# EAGLE design nau7802 (EAGLE 6.4)
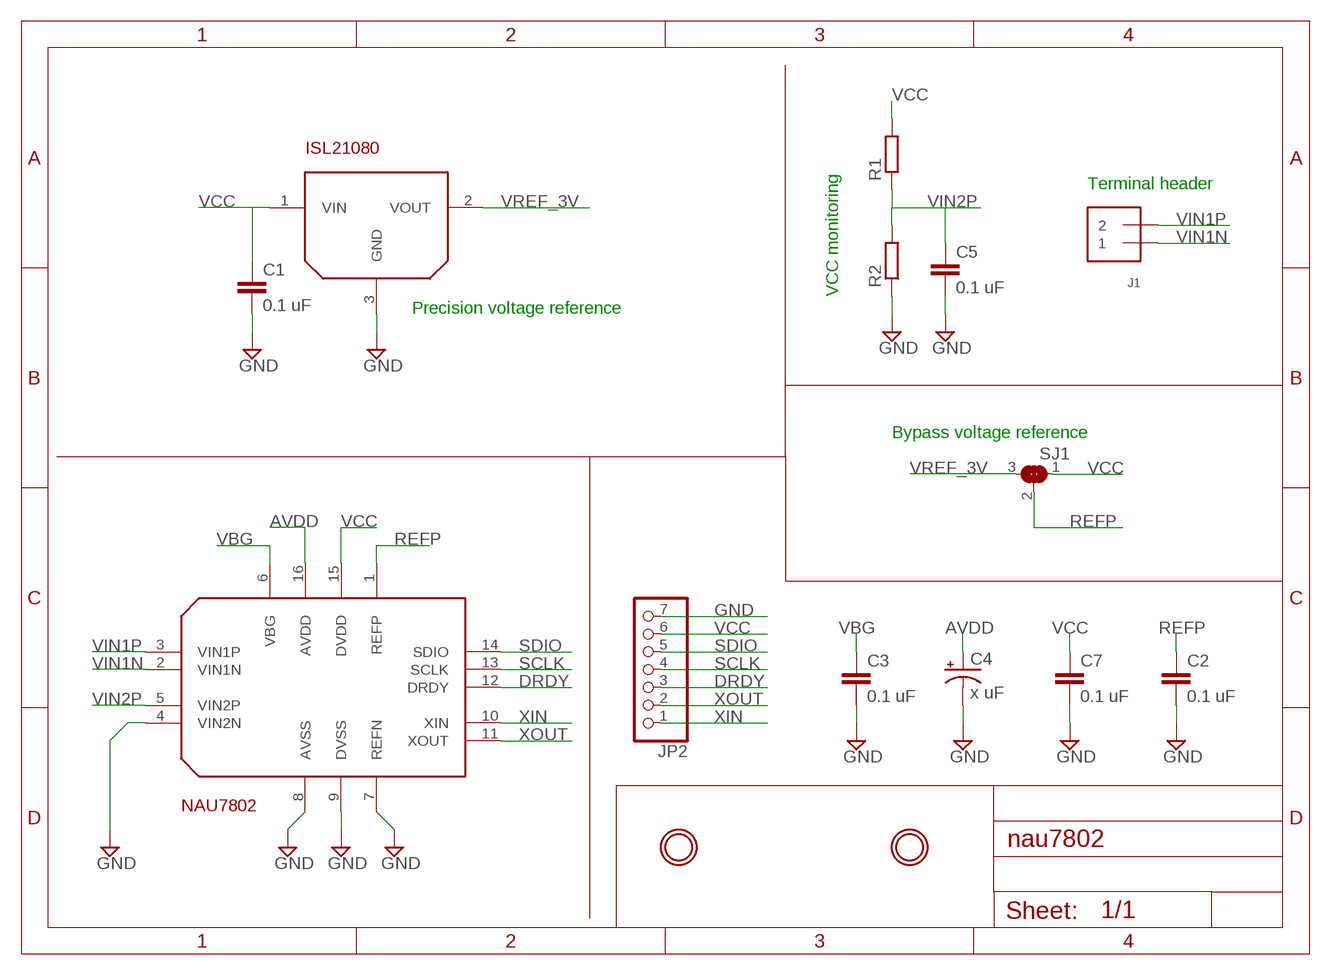
[diagram p0: schematic, sheet 1]

## Parts
C1  0.1 uF  C-EUC0805  [C0805]
C2  0.1 uF  C-EUC0805  [C0805]
C3  0.1 uF  C-EUC0805  [C0805]
C4  x uF  CPOL-USD/7343-31W  [D/7343-31W]
C5  0.1 uF  C-EUC0805  [C0805]
C7  0.1 uF  C-EUC0805  [C0805]
J1  TERMBLOCK_1X2  [TERMBLOCK_1X2-3.5MM]
JP2  PINHD-1X7  [1X07]
R1  R-EU_R0805  [R0805]
R2  R-EU_R0805  [R0805]
SJ1  SOLDERJUMPER_2WAY0805  [SOLDERJUMPER_2WAY_OPEN_0805]
U$1  IHSAN_NAU7802  [SO16]
U$3  IHSAN_ISL21080  [SOT23-3]
U$4  MOUNTINGHOLE3.0THIN  [MOUNTINGHOLE_3.0_PLATEDTHIN]
U$5  MOUNTINGHOLE3.0THIN  [MOUNTINGHOLE_3.0_PLATEDTHIN]

## Nets
AVDD: C4.+ U$1.16(AVDD)
DRDY: JP2.3 U$1.12(DRDY)
GND: C1.2 C2.2 C3.2 C4.- C5.2 C7.2 JP2.7 R2.1 U$1.4(VIN2N) U$1.7(REFN) U$1.8(AVSS) U$1.9(DVSS) U$3.3(GND)
REFP: C2.1 SJ1.2 U$1.1(REFP)
SCLK: JP2.4 U$1.13(SCLK)
SDIO: JP2.5 U$1.14(SDIO)
VBG: C3.1 U$1.6(VBG)
VCC: C1.1 C7.1 JP2.6 R1.2 SJ1.1 U$1.15(DVDD) U$3.1(VIN)
VIN1N: J1.1 U$1.2(VIN1N)
VIN1P: J1.2 U$1.3(VIN1P)
VIN2P: C5.1 R1.1 R2.2 U$1.5(VIN2P)
VREF_3V: SJ1.3 U$3.2(VOUT)
XIN: JP2.1 U$1.10(XIN)
XOUT: JP2.2 U$1.11(XOUT)

## Notes on the sheet
- Terminal header
- VCC monitoring
- Precision voltage reference
- Bypass voltage reference

## Library data of the parts
C1-C3 C5 C7 = rcl:C-EU: CAPACITOR, European symbol
C4 = rcl:CPOL-US: POLARIZED CAPACITOR, American symbol
J1 = microbuilder:TERMBLOCK_1X2: 3.5mm Terminal block http://www.ladyada.net/library/pcb/eaglelibrary.html
JP2 = pinhead:PINHD-1X7: PIN HEADER
R1 R2 = rcl:R-EU_: RESISTOR, European symbol
SJ1 = microbuilder:SOLDERJUMPER_2WAY: 2-Way Solder Jumper
U$1 = SparkFun-DigitalIC:IHSAN_NAU7802
U$3 = SparkFun-DigitalIC:IHSAN_ISL21080
U$4 U$5 = microbuilder:MOUNTINGHOLE: Mounting Hole For #2 screws (0.086"/2.18mm width, 0.094"/2.4mm hole) use 2.5mm

## Board
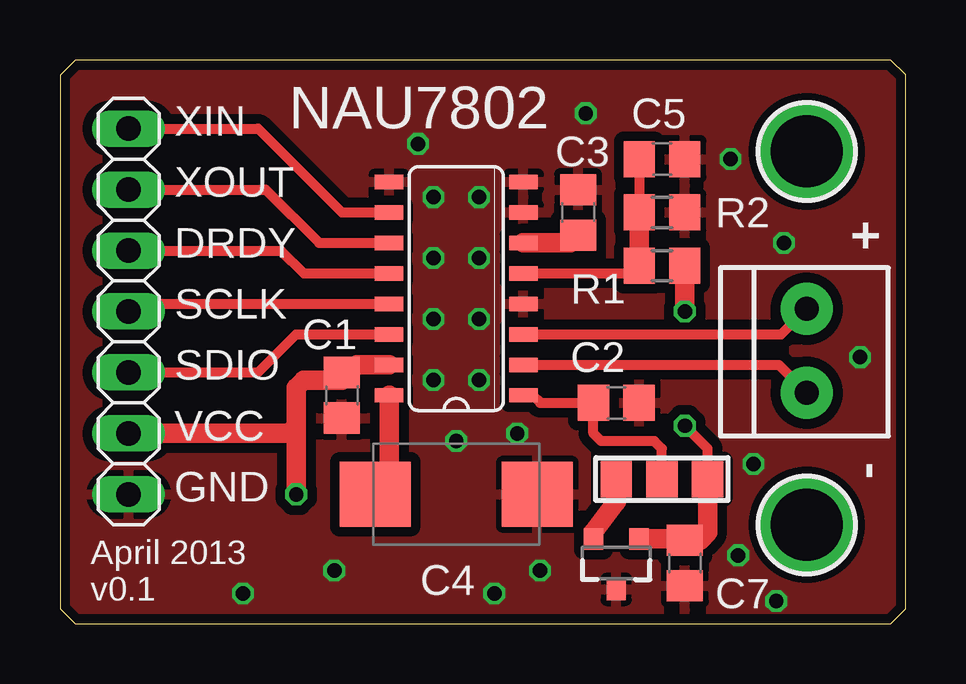
[diagram p1: board, top side]
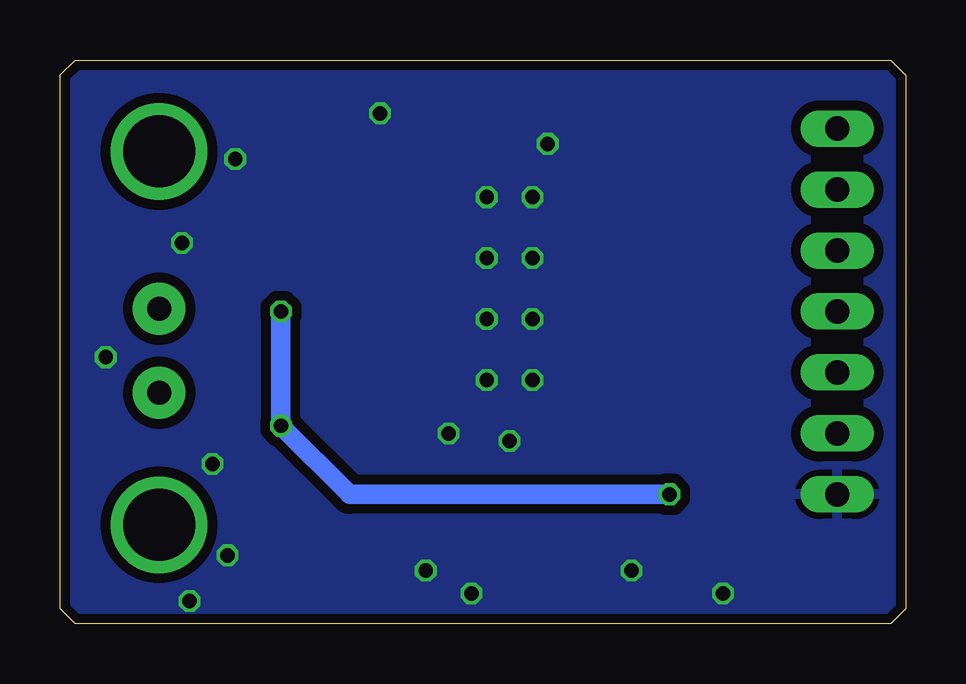
[diagram p2: board, bottom side, seen from below]

Size 35.24 x 23.5 mm. Coordinates in mm from the lower left corner, seen from the top.
Outline: 0.64,0 34.61,0 35.24,0.64 35.23,22.85 35.23,22.87 34.61,23.5 0.64,23.5 0,22.86 0,0.64 0.64,0
Copper layers (1*16): Top 0.035mm / dielectric 1.5mm / Bottom 0.035mm
Design rules "Fusion_eagle_rule_v1.1": minimum track width 6mil, minimum drill 12mil, track to track 6mil, track to pad 6mil, pad to pad 6mil, via to via 6mil, smd to smd 0mil, copper to edge 10mil, drill to drill 10mil, minimum pad ring 10mil, minimum via ring 6mil, stop-mask expansion 2mil, vias tented up to drill 100mil, thermal gap 10mil

### Footprints (pad centres in the part's own frame; a part is rotated, then mirrored left to right if it is on the bottom)
C0805 = smd 1.3 x 1.5: 1 -0.95,0; 2 0.95,0
D/7343-31W = smd 2.95 x 2.7: + 3.375,0; - -3.375,0
TERMBLOCK_1X2-3.5MM = drill 1 pad 2.184: 1 1.8,0; 2 -1.7,0
1X07 = drill 1.016 long: 1 -7.62,0; 2 -5.08,0; 3 -2.54,0; 4 0,0; 5 2.54,0; 6 5.08,0; 7 7.62,0
R0805 = smd 1.3 x 1.5: 1 -0.95,0; 2 0.95,0
SOLDERJUMPER_2WAY_OPEN_0805 = smd 1.3 x 1.5: 1 -1.9,0; 2 0,0; 3 1.9,0
SO16 = smd 0.6 x 1.2: 1 -4.445,-2.8; 2 -3.175,-2.8; 3 -1.905,-2.8; 4 -0.635,-2.8; 5 0.635,-2.8; 6 1.905,-2.8; 7 3.175,-2.8; 8 4.445,-2.8; 9 4.445,2.8; 10 3.175,2.8; 11 1.905,2.8; 12 0.635,2.8; 13 -0.635,2.8; 14 -1.905,2.8; 15 -3.175,2.8; 16 -4.445,2.8
SOT23-3 = smd 0.8 x 0.9: 1 -0.95,-1; 2 0.95,-1; 3 0,1.1
MOUNTINGHOLE_3.0_PLATEDTHIN = drill 3 pad 3.6: P$1 0,0

### Placement (x,y rotation side)
C1  11.75,9.53 270 top
C2  23.18,9.21 0 top
C3  21.59,17.14 90 top
C4  16.51,5.4 180 top
C5  25.08,19.37 0 top
C7  26.04,2.54 270 top
J1  31.11,11.43 270 top
JP2  2.86,13.02 270 top
R1  25.08,14.92 0 top
R2  25.08,17.14 180 top
SJ1  25.08,6.03 180 top
U$1  16.51,13.97 90 top
U$3  23.18,2.54 180 top
U$4  31.11,19.68 0 top
U$5  31.11,4.13 0 top

### Tracks (layer width: path | path; a pad name or v marks a point on that pad's centre or on a via)
AVDD
  Top 0.813: U$1.16 13.71,5.97 C4.+
DRDY
  Top 0.406: JP2.3 9.21,15.56 10.16,14.61 U$1.12
GND  (via drill 0.6)
  other vias: 11.43,2.22 7.62,1.27 20,2.22 18.1,1.27 17.46,12.7 15.56,17.78 17.46,15.24 15.56,15.24 17.46,10.16 15.56,10.16 33.34,11.11 14.92,20 21.91,21.27 27.94,19.37 30.16,15.88 28.89,6.67 29.84,0.95 28.26,2.86 16.51,7.62 19.05,7.94 15.56,12.7 17.46,17.78
  pour Top (isolate 0.406): -0.64,24.13 35.88,24.13 35.88,-0.64 -0.64,-0.64
  pour Bottom (isolate 0.406): -1.27,-1.27 36.51,-1.27 36.51,24.77 -1.27,24.77
REFP
  Top 0.406: U$1.1 19.68,9.53 20,9.21 C2.1 22.23,7.94 22.54,7.62 24.77,7.62 25.08,7.3 SJ1.2
SCLK
  Top 0.406: U$1.13 3.81,13.34 3.49,13.02 JP2.4
SDIO
  Top 0.406: U$1.14 9.84,12.06 8.57,10.79 8.25,10.48 7.93,10.48 JP2.5
VBG
  Top 0.813: U$1.6 21.27,15.88 C3.1
VCC  (via drill 0.6)
  Top 0.406: 12.06,10.16 C1.1 12.07,10.79 U$1.15 | 12.06,10.16 | 12.06,10.16 10.16,10.16 | SJ1.1 26.98,7.31 v26.04,8.26 | R1.2
  Top 0.813: v26.04,13.02 R1.2 | U$1.15 12.38,10.79 11.75,10.16 10.16,10.16 9.84,9.84 9.84,8.26 | 9.84,8.26 v9.84,5.4 | JP2.6 9.53,7.94 9.84,8.26 | C7.1 25.98,3.54 U$3.1 25.99,3.54 C7.1 26.67,3.49 26.99,3.81 SJ1.1
  Bottom 0.813: v26.04,13.02 v26.04,8.26 23.18,5.4 v9.84,5.4
VIN1N
  Top 0.406: U$1.2 29.95,10.79 J1.1
VIN1P
  Top 0.406: U$1.3 30.05,12.06 J1.2
VIN2P
  Top 0.406: U$1.5 23.82,14.61 R1.1 | C5.1 R2.2
  Top 0.813: R2.2 R1.1
VREF_3V
  Top 0.813: SJ1.3 23.18,5.08 22.23,3.81 U$3.2
XIN
  Top 0.406: JP2.1 8.26,20.64 11.75,17.14 U$1.10
XOUT
  Top 0.406: JP2.2 8.57,18.1 10.79,15.88 U$1.11

### Text on the board
tNames: NAU7802 | XIN | XOUT | + | DRDY | SCLK | SDIO | VCC | - | GND | April 2013 / v0.1